# Altium schematic sheet SR-26424.SchDoc
size A4
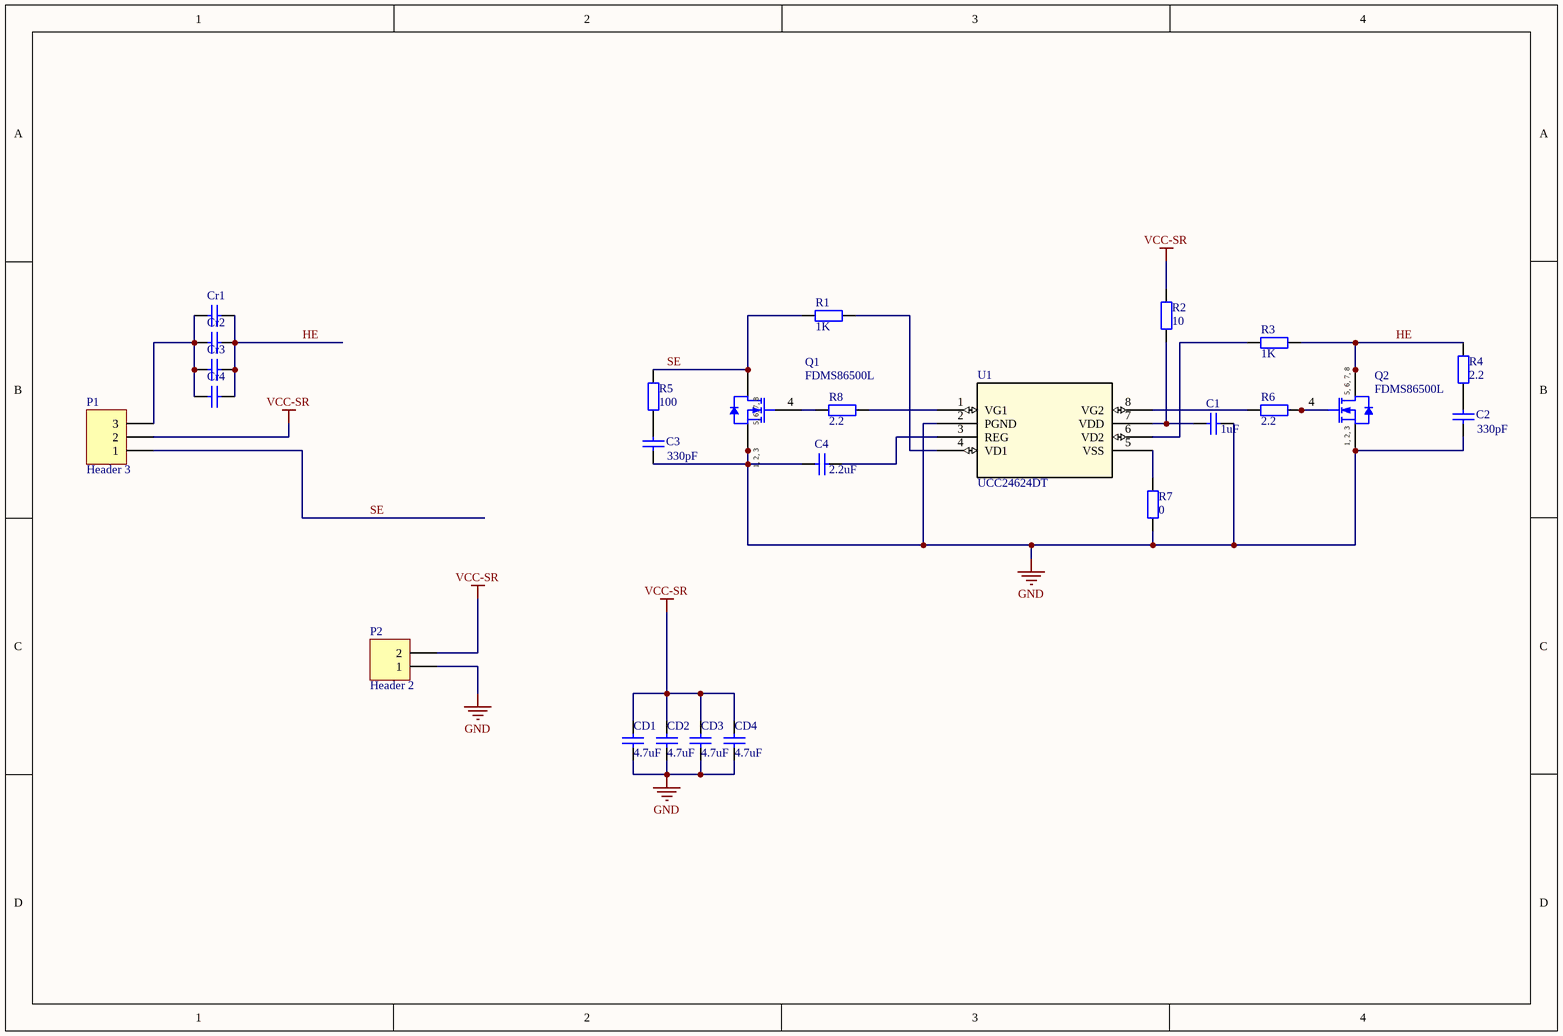
[diagram p0: SR-26424.SchDoc]

## Parts
C1  value 1uF  [C0603]  (hidden comment: Cap)
C2  value 330pF  [0603-C]  (hidden comment: Cap)
C3  value 330pF  [0603-C]  (hidden comment: Cap)
C4  value 2.2uF  [C0603]  (hidden comment: Cap)
CD1  value 4.7uF  [0603-C]  (hidden comment: Cap)
CD2  value 4.7uF  [0603-C]  (hidden comment: Cap)
CD3  value 4.7uF  [0603-C]  (hidden comment: Cap)
CD4  value 4.7uF  [0603-C]  (hidden comment: Cap)
Cr1  Cap  [C0805]  (value not drawn)
Cr2  Cap  [C0805]  (value not drawn)
Cr3  Cap  [C0805]  (value not drawn)
Cr4  Cap  [C0805]  (value not drawn)
P1  Header 3  [3PIN-5.08B]
P2  Header 2  [2PIN-5.08B]
Q1  FDMS86500L  [INF-PG-TDSON-8-1_V]
Q2  FDMS86500L  [INF-PG-TDSON-8-1_V]
R1  value 1K  [R0603]  (hidden comment: Res2)
R2  value 10  [R0603]  (hidden comment: Res2)
R3  value 1K  [R0603]  (hidden comment: Res2)
R4  value 2.2  [R0603]  (hidden comment: Res2)
R5  value 100  [R0603]  (hidden comment: Res2)
R6  value 2.2  [R0603]  (hidden comment: Res2)
R7  value 0  [R0603]  (hidden comment: Res2)
R8  value 2.2  [R0603]  (hidden comment: Res2)
U1  UCC24624DT  [SOIC_4624DT_TEX]

## Nets
GND: C1.1 C2.1 C3.1 C4.2 CD1.1 CD2.1 CD3.1 CD4.1 P2.1 Q1.1(SOURCE) Q1.2(SOURCE) Q1.3(SOURCE) Q2.1(SOURCE) Q2.2(SOURCE) Q2.3(SOURCE) R7.1 U1.2(PGND)
VCC-SR: CD1.2 CD2.2 CD3.2 CD4.2 P1.2 P2.2 R2.1
HE: Cr1.2 Cr2.2 Cr3.2 Cr4.2 Q2.5(DRAIN) Q2.6(DRAIN) Q2.7(DRAIN) Q2.8(DRAIN) R3.1 R4.2
SE: P1.1 Q1.5(DRAIN) Q1.6(DRAIN) Q1.7(DRAIN) Q1.8(DRAIN) R1.2 R5.2
NetC1_2: C1.2 R2.2 U1.7(VDD)
NetC2_2: C2.2 R4.1
NetC3_2: C3.2 R5.1
NetC4_1: C4.1 U1.3(REG)
NetCr1_1: Cr1.1 Cr2.1 Cr3.1 Cr4.1 P1.3
NetQ1_4: Q1.4(GATE) R8.2
NetQ2_4: Q2.4(GATE) R6.1
NetR1_1: R1.1 U1.4(VD1)
NetR3_2: R3.2 U1.6(VD2)
NetR6_2: R6.2 U1.8(VG2)
NetR7_2: R7.2 U1.5(VSS)
NetR8_1: R8.1 U1.1(VG1)

## Notes on the sheet
- (in symbol BSC190N15NS3 G) 5, 6, 7, 8; 1, 2, 3

## Library data of the parts
C1-C4 CD1-CD4 = Cap: Capacitor; Published: 8-Jun-2000; LatestRevisionDate: 17-Jul-2002; LatestRevisionNote: Re-released for DXP Platform.; PackageReference: RAD-0.3; Publisher: Altium Limited; PackageDescription: Radial Cap, Thru-Hole; 2 Leads; 0.3 in Pin Spacing
Cr1-Cr4 = Cap: Capacitor; Value: 100pF; Published: 8-Jun-2000; LatestRevisionDate: 17-Jul-2002; LatestRevisionNote: Re-released for DXP Platform.; PackageReference: RAD-0.3; Publisher: Altium Limited; PackageDescription: Radial Cap, Thru-Hole; 2 Leads; 0.3 in Pin Spacing
P1 = Header 3: Header, 3-Pin; LatestRevisionDate: 17-Jul-2002; LatestRevisionNote: Re-released for DXP Platform.; Publisher: Altium Limited
P2 = Header 2: Header, 2-Pin; LatestRevisionDate: 17-Jul-2002; LatestRevisionNote: Re-released for DXP Platform.; Publisher: Altium Limited
Q1 Q2 = BSC190N15NS3 G: N-Channel OptiMOS 3 Power-Transistor, 150燰 VDS, 50燗 ID, -55 to 150 degC, PG-TDSON-8-1, Reel, Green; Manufacturer: Infineon; Green: TRUE; IDpuls (max): 200燗; Polarity: N; Ptot (max): 125燱; QG: 23爊C; RDS (on) (max): 19爉Ohm; Rth: 1燢/W; RthJA (max): 50燢/W; VGS(th) (max): 4燰; VGS(th) (min): 2燰; DatasheetVersion: Rev. 2.4; PackageReference: PG-TDSON-8-1; PackageDescription: 8-Pin Plastic (Green) Thin Dual Small Outline Non-Leaded Package, 5.15 x 5.9 mm Body, 1.27 mm Pitch; Supplier 1: Digi-Key; Supplier Part Number 1: BSC190N15NS3 GTR-ND; Supplier 2: Digi-Key; Supplier Part Number 2: BSC190N15NS3 GCT-ND; Supplier 3: Digi-Key; Supplier Part Number 3: BSC190N15NS3 GDKR-ND; Supplier 4: Mouser; Supplier Part Number 4: 726-BSC190N15NS3G; Halogen-free: TRUE; ID (max): 50燗; Packing: Reel; RthJC (max): 1燢/W; VDS (max): 150燰; Mounting Technology: Surface Mount; PartNumber: BSC190N15NS3 G; ComponentLink1Description: Manufacturer URL; ComponentLink1URL: http://www.infineon.com/; ComponentLink2Description: Datasheet; ComponentLink2URL: http://www.infineon.com/dgdl/BSC190N15NS3_Rev2.4.pdf?folderId=db3a304313b8b5a60113cee8763b02d7&fileId=db3a30431d8a6b3c011d8bf2fcf30076; ComponentLink3Description: Package Specification; ComponentLink3URL: http://www.infineon.com/cms/packages/SMD_-_Surface_Mounted_Devices/P-PG-TDSON/P-PG-TDSON-08-01x_2x_3.html?__locale=en
R1-R8 = Res2: Resistor; Published: 8-Jun-2000; LatestRevisionDate: 17-Jul-2002; LatestRevisionNote: Re-released for DXP Platform.; PackageReference: AXIAL-0.4; Publisher: Altium Limited; PackageDescription: Axial Device, Thru-Hole; 2 Leads; 0.4 in Pin Spacing
U1 = UCC24624DT: No Description Available; Vendor: Texas Instruments; Built_By: EMA_Matt; SourceLibrary: Add_to_database_2021-01-26; Datasheet: https://www.ti.com/lit/ds/symlink/ucc24624.pdf?HQS=dis-dk-null-digikeymode-dsf-pf-null-wwe&ts=1611606531409; Copyright: Copyright (C) 2018 Accelerated Designs. All rights reserved; Manufacturer_Part_Number: UCC24624DT; RefDes: RefDes; Type: DEV